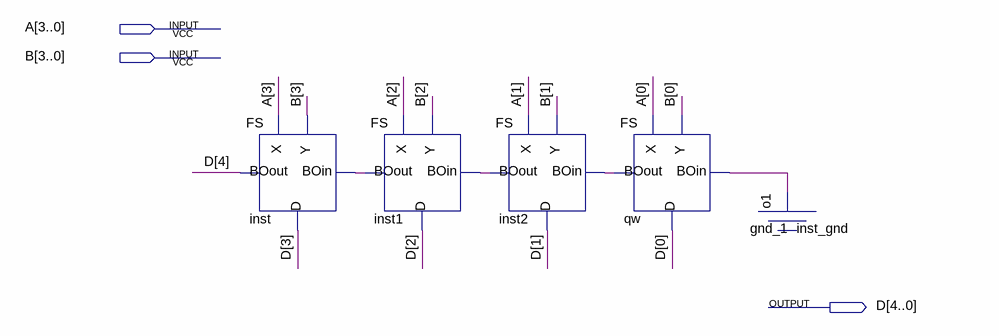
[diagram p0: schematic sheet]
// Quartus schematic FS4.bdf as structural Verilog: 5 symbols, 3 pins
module FS4 (
  input  [3:0] A,
  input  [3:0] B,
  output [4:0] D
);

  wire inst1_boout, inst2_boout, inst_gnd_o1, qw_boout;

  FS inst (.X(A[3]), .Y(B[3]), .BOin(inst1_boout), .D(D[3]), .BOout(D[4]));
  FS inst1 (.X(A[2]), .Y(B[2]), .BOin(inst2_boout), .D(D[2]), .BOout(inst1_boout));
  FS inst2 (.X(A[1]), .Y(B[1]), .BOin(qw_boout), .D(D[1]), .BOout(inst2_boout));
  FS qw (.X(A[0]), .Y(B[0]), .BOin(inst_gnd_o1), .D(D[0]), .BOout(qw_boout));
  gnd_1 inst_gnd (.o1(inst_gnd_o1));
endmodule
